# EAGLE design V21-Selector-Keyboard-Relay-K-R-RevD-S (EAGLE 8.3.1)
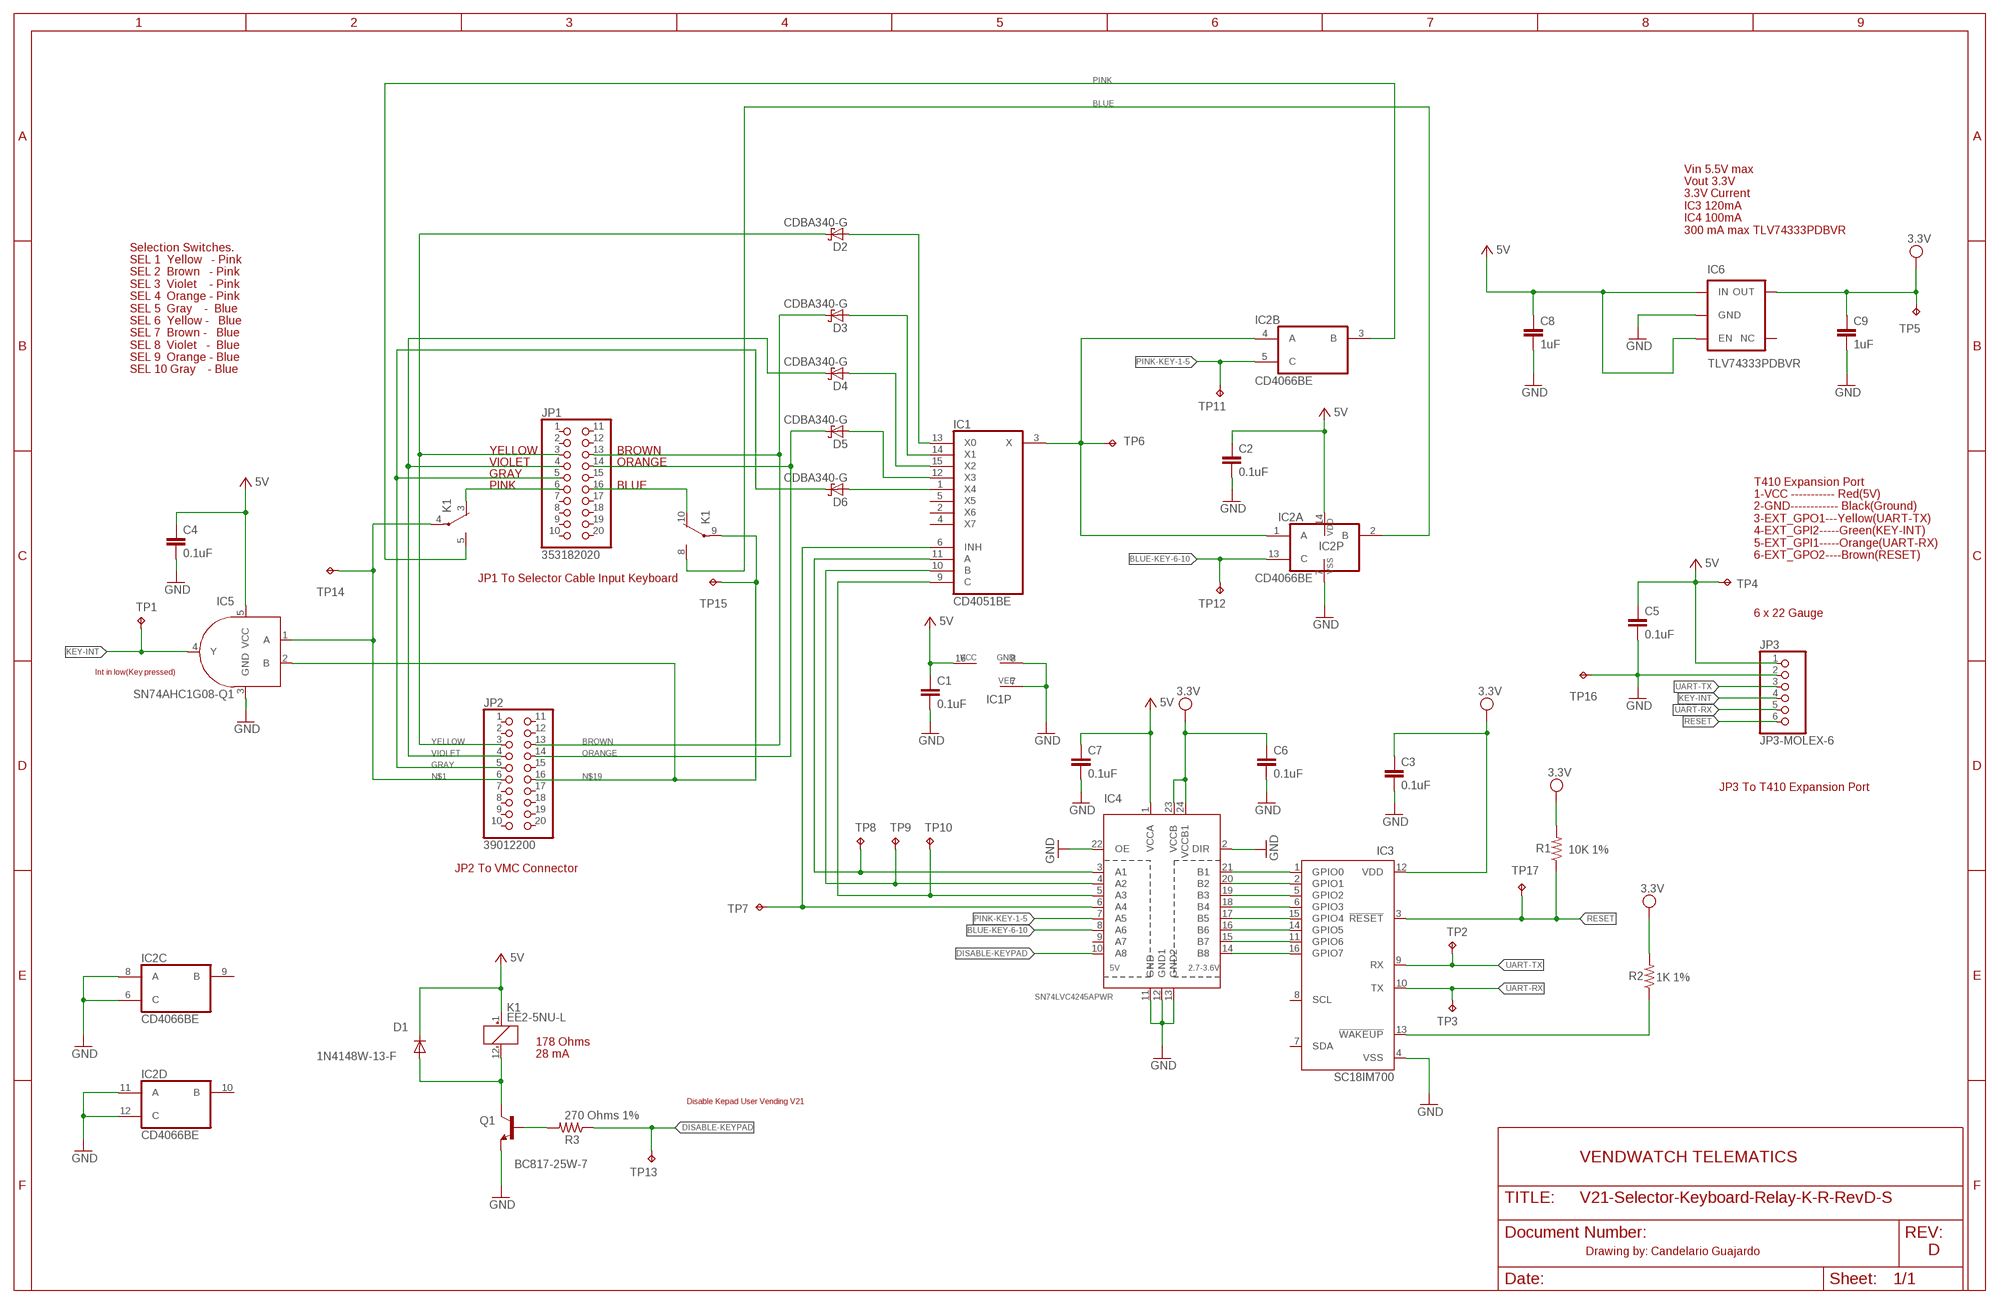
[diagram p0: schematic, sheet 1]

## Parts
C1  0.1uF  CAP0805  [0805]
C2  0.1uF  CAP0805  [0805]
C3  0.1uF  CAP0805  [0805]
C4  0.1uF  CAP0805  [0805]
C5  0.1uF  CAP0805  [0805]
C6  0.1uF  CAP0805  [0805]
C7  0.1uF  CAP0805  [0805]
C8  1uF  CAP0805  [0805]
C9  1uF  CAP0805  [0805]
D1  1N4148W-13-F  DIODESOD-123  [SOD-123]
D2  CDBA340-G  [DO-214AC-SMA]
D3  CDBA340-G  [DO-214AC-SMA]
D4  CDBA340-G  [DO-214AC-SMA]
D5  CDBA340-G  [DO-214AC-SMA]
D6  CDBA340-G  [DO-214AC-SMA]
IC1  CD4051BE  4051D  [SO16]
IC2  CD4066BE  4066D  [SO14]
IC3  SC18IM700  [TSSOP16]
IC4  SN74LVC4245APWR  SN74LVC4245  [SOIC24]
IC5  SN74AHC1G08-Q1  74AHC1G08  [SOT23-5]
IC6  TLV74333PDBVR  [SOT-23-5]
JP1  353182020  [2X10-4.2MM-TH-RA]
JP2  39012200  [2X10-4.2MM-FS-CRIMP]
JP3  JP3-MOLEX-6  [HEADER-1X6-22-GAUGE-OVAL]
K1  EE2-5NU-L  [DPDT-2-FROM-C-EE2]
Q1  BC817-25W-7  TRANSISTOR-NPN  [SOT323]
R1  10K 1%  RESISTOR0805-RES  [0805]
R2  1K 1%  RESISTOR0805-RES  [0805]
R3  270 Ohms 1%  RESISTOR0805-RES  [0805]
TP1  TPB1,27  [B1,27]
TP2  TPB1,27  [B1,27]
TP3  TPB1,27  [B1,27]
TP4  TPB1,27  [B1,27]
TP5  TPB1,27  [B1,27]
TP6  TPB1,27  [B1,27]
TP7  TPB1,27  [B1,27]
TP8  TPB1,27  [B1,27]
TP9  TPB1,27  [B1,27]
TP10  TPB1,27  [B1,27]
TP11  TPB1,27  [B1,27]
TP12  TPB1,27  [B1,27]
TP13  TPB1,27  [B1,27]
TP14  TPB1,27  [B1,27]
TP15  TPB1,27  [B1,27]
TP16  TPB1,27  [B1,27]
TP17  TPB1,27  [B1,27]

## Nets
3.3V: C3.1 C6.1 C9.1 IC3.12(VDD) IC4.23(VCCB) IC4.24(VCCB1) IC6.5(OUT) R1.2 R2.2 TP5.TP
5V: C1.1 C2.1 C4.1 C5.1 C7.1 C8.1 D1.C IC1.16(VCC) IC2.14(P:VDD) IC4.1(VCCA) IC5.5(VCC) IC6.1(IN) IC6.3(EN) JP3.1 K1.1(K$1:+) TP4.TP
BLUE: IC2.2(A:B) K1.8(S)
BLUE-KEY-6-10: IC2.13(A:C) IC4.8(A6) TP12.TP
BROWN: D3.K(C) JP1.13 JP2.13
DISABLE-KEYPAD: IC4.10(A8) R3.1 TP13.TP
GND: C1.2 C2.2 C3.2 C4.2 C5.2 C6.2 C7.2 C8.2 C9.2 IC1.7(VEE) IC1.8(GND) IC2.6(C:C) IC2.7(P:VSS) IC2.8(C:A) IC2.11(D:A) IC2.12(D:C) IC3.4(VSS) IC4.2(DIR) IC4.11(GND) IC4.12(GND1) IC4.13(GND2) IC4.22(OE) IC5.3(GND) IC6.2(GND) JP3.2 Q1.2(E) TP16.TP
GRAY: D6.K(C) JP1.5 JP2.5
KEY-INT: IC5.4(Y) JP3.4 TP1.TP
N$1: IC5.1(A) JP2.6 K1.4(P) TP14.TP
N$3: JP1.6 K1.3(O)
N$4: JP1.16 K1.10(O)
N$5: IC3.13(!WAKEUP) R2.1
N$6: IC3.1(GPIO0) IC4.21(B1)
N$7: IC3.2(GPIO1) IC4.20(B2)
N$8: IC1.6(INH) IC4.6(A4) TP7.TP
N$9: IC1.3(X) IC2.1(A:A) IC2.4(B:A) TP6.TP
N$10: IC3.5(GPIO2) IC4.19(B3)
N$11: IC3.6(GPIO3) IC4.18(B4)
N$12: IC1.11(A) IC4.3(A1) TP8.TP
N$13: IC1.10(B) IC4.4(A2) TP9.TP
N$14: IC1.9(C) IC4.5(A3) TP10.TP
N$15: IC3.15(GPIO4) IC4.17(B5)
N$16: IC3.14(GPIO5) IC4.16(B6)
N$17: IC3.11(GPIO6) IC4.15(B7)
N$18: IC3.16(GPIO7) IC4.14(B8)
N$19: IC5.2(B) JP2.16 K1.9(P) TP15.TP
N$20: D1.A K1.12(K$1:-) Q1.3(C)
N$21: D2.A IC1.13(X0)
N$22: Q1.1(B) R3.2
N$24: D3.A IC1.14(X1)
N$25: D4.A IC1.15(X2)
N$26: D5.A IC1.12(X3)
N$27: D6.A IC1.1(X4)
ORANGE: D5.K(C) JP1.14 JP2.14
PINK: IC2.3(B:B) K1.5(S)
PINK-KEY-1-5: IC2.5(B:C) IC4.7(A5) TP11.TP
RESET: IC3.3(!RESET) JP3.6 R1.1 TP17.TP
UART-RX: IC3.10(TX) JP3.5 TP3.TP
UART-TX: IC3.9(RX) JP3.3 TP2.TP
VIOLET: D4.K(C) JP1.4 JP2.4
YELLOW: D2.K(C) JP1.3 JP2.3
Unconnected: IC1.2(X6) IC1.4(X7) IC1.5(X5) IC2.9(C:B) IC2.10(D:B) IC3.7(SDA) IC3.8(SCL) IC4.9(A7) IC6.4(NC) JP1.1 JP1.2 JP1.7 JP1.8 JP1.9 JP1.10 JP1.11 JP1.12 JP1.15 JP1.17 JP1.18 JP1.19 JP1.20 JP2.1 JP2.2 JP2.7 JP2.8 JP2.9 JP2.10 JP2.11 JP2.12 JP2.15 JP2.17 JP2.18 JP2.19 JP2.20

## Notes on the sheet
- Vin 5.5V max
  Vout 3.3V
  3.3V Current
  IC3 120mA
  IC4 100mA
  300 mA max TLV74333PDBVR
- Selection Switches.
  SEL 1  Yellow   - Pink
  SEL 2  Brown   - Pink
  SEL 3  Violet    - Pink
  SEL 4  Orange - Pink
  SEL 5  Gray    -  Blue
  SEL 6  Yellow -   Blue
  SEL 7  Brown -   Blue
  SEL 8  Violet   -  Blue
  SEL 9  Orange - Blue
  SEL 10 Gray    - Blue
- YELLOW | BROWN
- VIOLET | ORANGE
- GRAY
- PINK | BLUE
- T410 Expansion Port
  1-VCC ----------- Red(5V)
  2-GND------------ Black(Ground)
  3-EXT_GPO1---Yellow(UART-TX)
  4-EXT_GPI2-----Green(KEY-INT)
  5-EXT_GPI1-----Orange(UART-RX) 
  6-EXT_GPO2----Brown(RESET)
- JP1 To Selector Cable Input Keyboard
- 6 x 22 Gauge
- Int in low(Key pressed)
- JP3 To T410 Expansion Port
- JP2 To VMC Connector
- 178 Ohms
  28 mA
- Disable Kepad User Vending V21
- VENDWATCH TELEMATICS
- Drawing by: Candelario Guajardo | D

## Library data of the parts
C1-C9 = SparkFun-Capacitors:CAP: Capacitor Standard 0603 ceramic capacitor, and 0.1" leaded capacitor.
D1 = microbuilder:DIODE: Diode SMA Model Volts Amps Type Vf Vr Digikey # Notes SSA34-E3 40V 3A Schottky 480mV @ 3A 200uA @ 40V SSA34-E3/61TGITR-ND CDBA120-G 20V 1A Schottky 500mV @ 1A 500uA @ 20V 641-1014-6-ND REEL MBRA210 10V 2A Schottky 350mV @ 2A 700uA @ 10V MBRA210LT3 SOD-123 Model Volts Amps Type Vf Vr Order # Notes BAT54T1G 30V 200mA Schottky 800mV @ 200mA 2uA @ 25V BAT54T1GOSTR-ND B0530W 30V 500mA Schottky 430mV @ 500mA 130uA @ 30V B0530W-FDICT-ND REEL MBR120 1A 20V Schottky 340mV @ 1A MBR120VLSFT1GOSCT-ND SOD-323 Model Volts Amps Type Vf Vr Order # Notes PMEG2005EJ 20V 500mA Schottky 355mV @ 500mA 568-4110-1-ND ZLLS410 10V 570mA Schottky 380mV @ 570mA ZLLS410CT-ND 1N4148WS 75V 150mA Silicon/Simple 1V 1N4148WSFSCT-ND REEL SOD-523 Model Volts Amps Type Vf Vr Order # Notes BAT54XV2 30V 200mA Schottky 0.8V @ 100mA BAT54XV2CT-ND TB751S 30V 30mA Schottky RB751S-40TE61CT-ND SOT23-R/W (R = Solder Paste/Reflow Ovens, W = Hand-Soldering) Model Volts Amps Type Vf Vr Order # Notes BAT54FILM 40V 300mA Schottky 497-7162-1-ND
D2-D6 = Comchip-Technology-Schottky Diodes:CDBA340-G: Schottky Diodes & Rectifiers Schottky Barr Rectfr 40V, 3A SMD/SMT DO-214AC-2 Vf 0.5V Ir 0.5mA Comchip Technology CDBA340-G
IC1 = 40xx:4051: 8-channel ANALOG MULTIPLEXER
IC2 = 40xx:4066: Quad bilateral ANALOG SWITCH
IC3 = uart-gpio:SC18IM700: I/O Controller Interface IC Master I2C-bus Controller w/UART SMD/SMT TSSOP-16 I/O Controllers I2C, UART 8 I/O Operatng Supply Voltaje 2.4V to 3.6V NXP SC18IM700IPW/S8HP; MANUFACTURER: NXP Semiconductors; MPN: SC18IM700IPW/S8HP
IC4 = VoltajeTranslatorSOIC:SN74LVC4245: SN74LVC4245ADW OCTAL BUS TRANSCEIVER AND 3.3V TO 5V SHIFTER WITH 3 STATE OUTPUTS
IC5 = SparkFun-DigitalIC:74AHC1G08: Single 2-input AND gate
IC6 = Texas-LDO:TLV74333PDBVR: LDO Voltage Regulators 300mA Low-Dropout (LDO) Regulator SOT-23-5 SMD/SMT 3.3V Input Voltage Max 5.5V Temperature -40C to 125C Texas Instruments TLV74333PDBVR
JP1 = Molex-Mini-Fit-Jr:353182020: Connector Header Through Hole, Right Angle 20 position 0.165" (4.20mm) MOLEX Mini-Fit-Jr 035182020
JP2 = Molex-Mini-Fit-Jr:39012200
JP3 = MOLEX-Nano-Fit:JP3-MOLEX-6
K1 = Kemet-Relay:EE2-5NU-L: General Purpose Relay DPDT (2 Form C) Surface Mount Coil Voltage 5VDC Contact Form DPDT (2 Form 2) 2A Contact Rating Switching Voltage 250VAC, 220VDC-Max Coil Current 28mA Coil Type Non Latching Must Operate Voltage 3.75 VDC Must Release Voltage 0.5 VDC Operate Time 2ms Release Time 1ms Contact Material Silver Alloy, Gold Alloy Coil Resistance 178 Ohms KEMET EE2-5NU-L
Q1 = TRANSISTOR-NPN-Q1:TRANSISTOR-NPN: SMALL SIGNAL TRANSISTOR NPN 45V IN SOT323
R1-R3 = SparkFun-Resistors:RESISTOR: Resistor Basic schematic elements and footprints for 0603, 1206, and PTH resistors.
TP1-TP17 = testpad:TP: Test pad

## Net classes
2 VCC: width 0.254 mm, clearance 0.203 mm

## Board
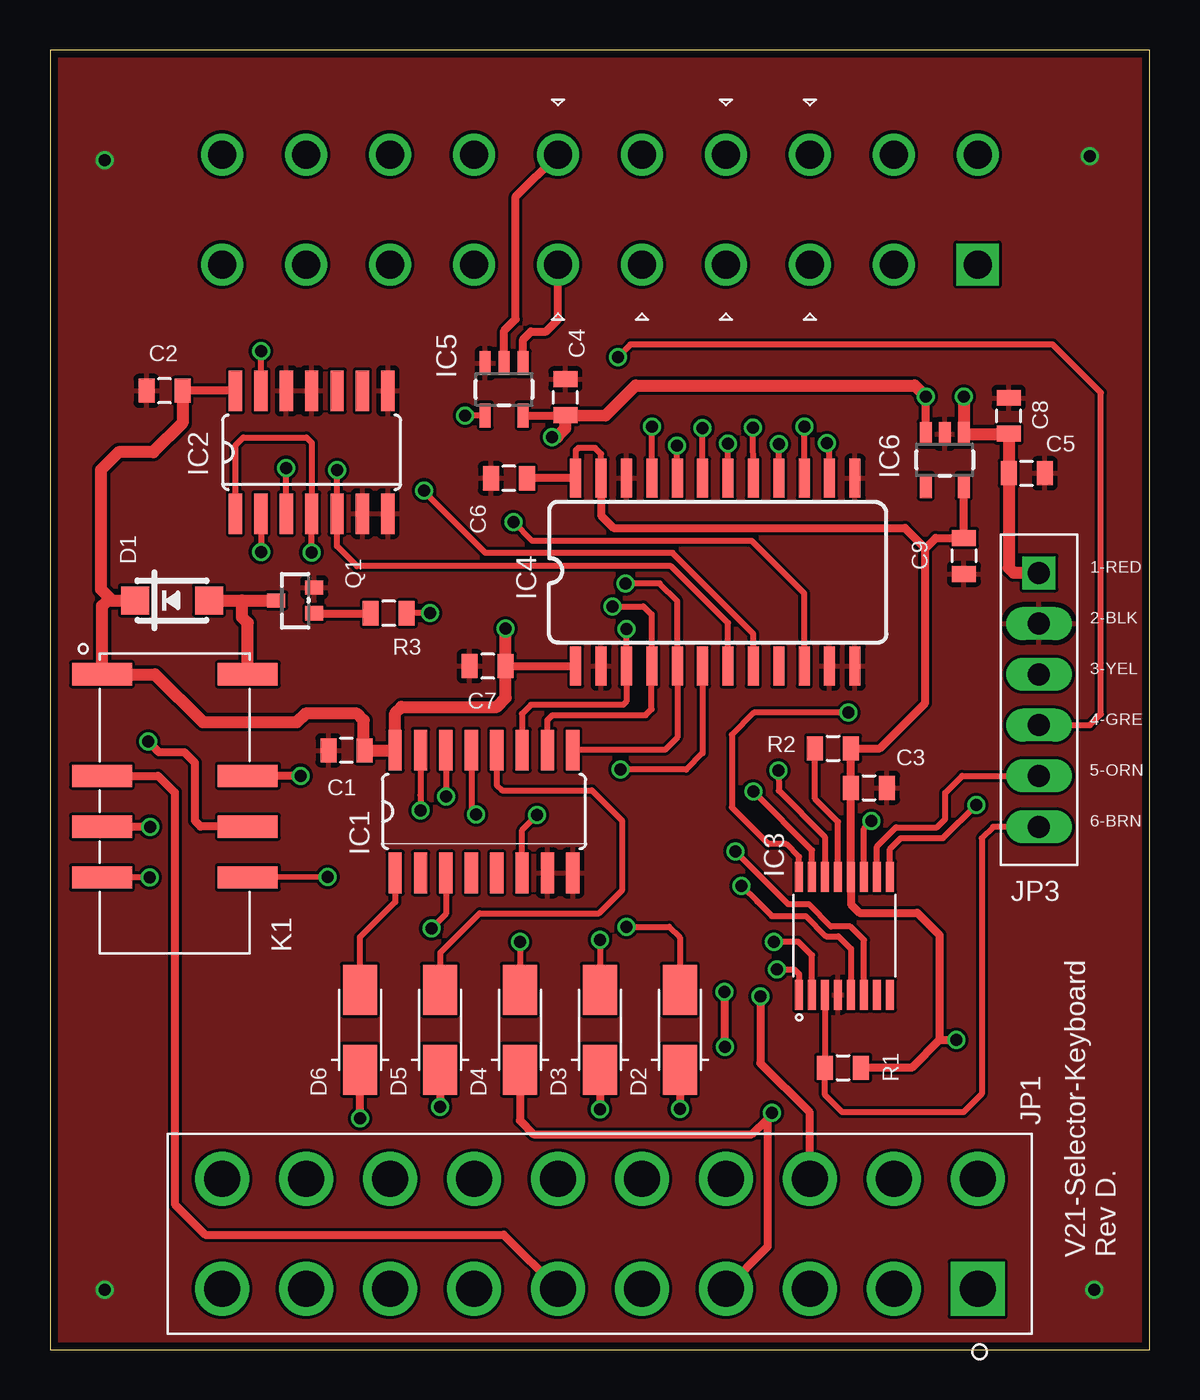
[diagram p1: board, top side]
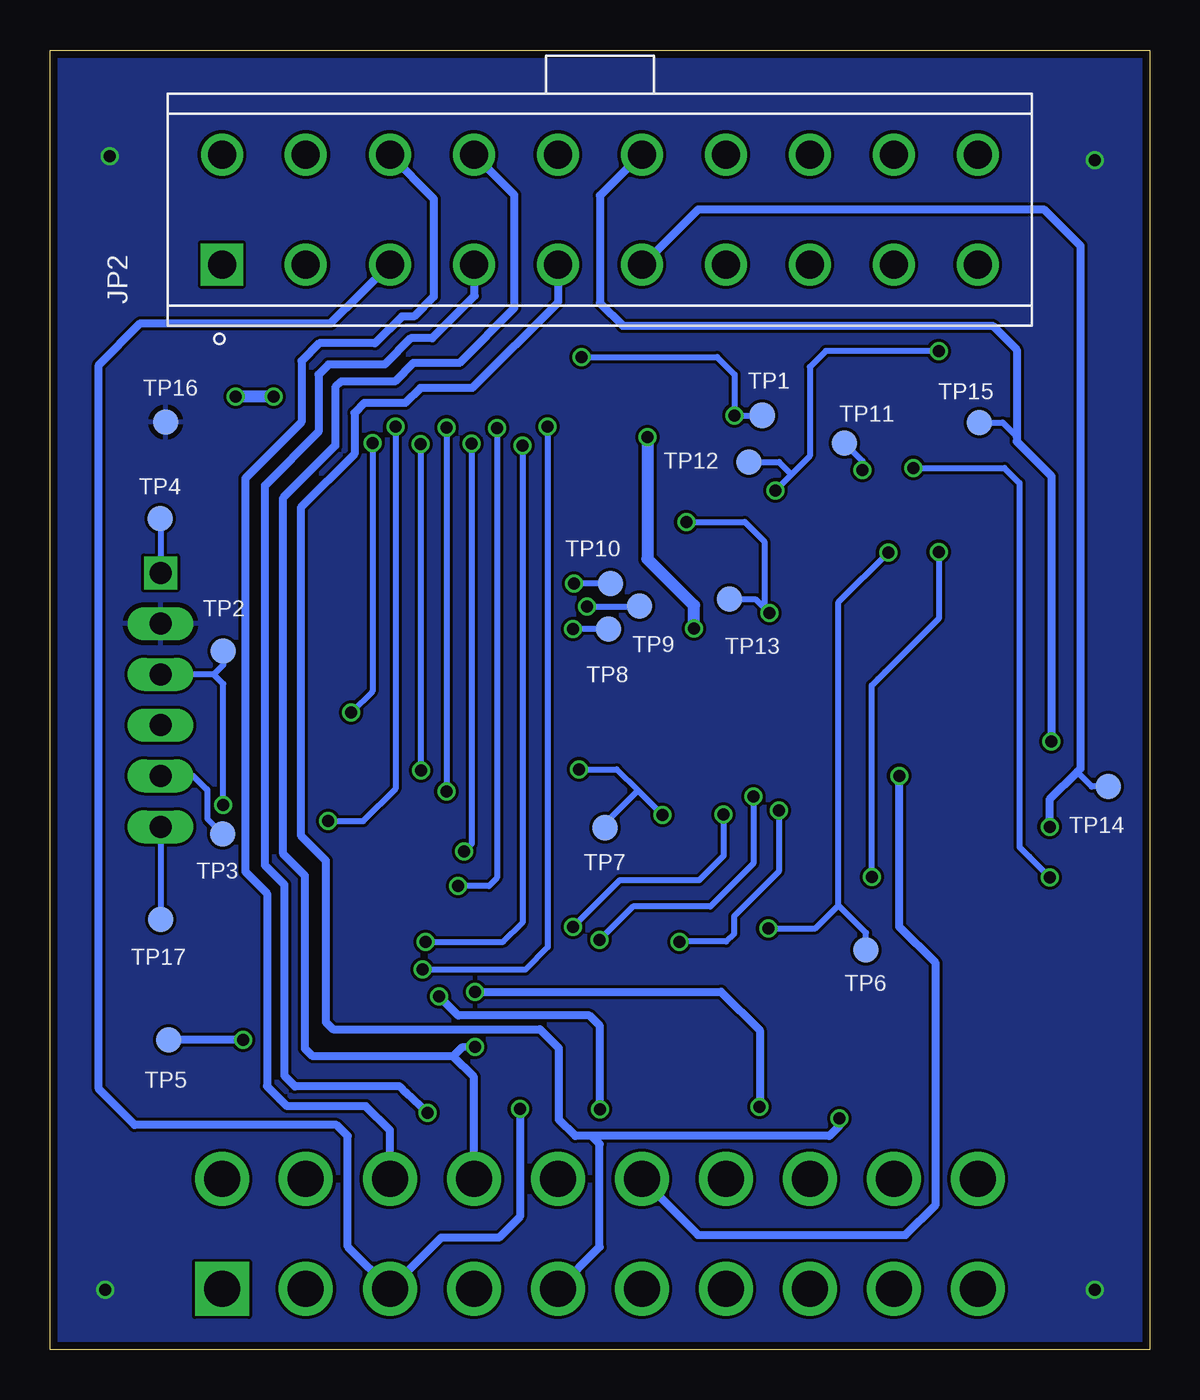
[diagram p2: board, bottom side, seen from below]

Size 55 x 65 mm. Coordinates in mm from the lower left corner, seen from the top.
Outline: 0,0 55,0 55,65 0,65 0,0
Copper layers (1*16): Top 0.035559375mm / dielectric 1.6mm / Bottom 0.035559375mm
Design rules "oshpark-2layer": minimum track width 6mil, minimum drill 10mil, track to track 6mil, track to pad 6mil, pad to pad 6mil, via to via 6mil, smd to smd 6mil, copper to edge 15mil, drill to drill 6mil, minimum pad ring 5mil, minimum via ring 5mil, stop-mask expansion 2.5mil, vias tented up to drill 0mil, thermal gap 10mil

### Footprints (pad centres in the part's own frame; a part is rotated, then mirrored left to right if it is on the bottom)
0805 = smd 0.8 x 1.2: 1 -0.9,0; 2 0.9,0
SOD-123 = smd 1.4 x 1.4: A 1.85,0; C -1.85,0
DO-214AC-SMA = smd 2.5 x 1.7: A 2,0; K -2,0
SO16 = smd 0.66 x 2.032: 1 -4.445,-3.073; 2 -3.175,-3.073; 3 -1.905,-3.073; 4 -0.635,-3.073; 5 0.635,-3.073; 6 1.905,-3.073; 7 3.175,-3.073; 8 4.445,-3.073; 9 4.445,3.073; 10 3.175,3.073; 11 1.905,3.073; 12 0.635,3.073; 13 -0.635,3.073; 14 -1.905,3.073; 15 -3.175,3.073; 16 -4.445,3.073
SO14 = smd 0.66 x 2.032: 1 -3.81,-3.073; 2 -2.54,-3.073; 3 -1.27,-3.073; 4 0,-3.073; 5 1.27,-3.073; 6 2.54,-3.073; 7 3.81,-3.073; 8 3.81,3.073; 9 2.54,3.073; 10 1.27,3.073; 11 0,3.073; 12 -1.27,3.073; 13 -2.54,3.073; 14 -3.81,3.073
TSSOP16 = smd 0.4 x 1.5: 1 -2.275,-2.95; 2 -1.625,-2.95; 3 -0.975,-2.95; 4 -0.325,-2.95; 5 0.325,-2.95; 6 0.975,-2.95; 7 1.625,-2.95; 8 2.275,-2.95; 9 2.275,2.95; 10 1.625,2.95; 11 0.975,2.95; 12 0.325,2.95; 13 -0.325,2.95; 14 -0.975,2.95; 15 -1.625,2.95; 16 -2.275,2.95
SOIC24 = smd 0.55 x 1.95: 1 -8.315,-4.7; 2 -7.045,-4.7; 3 -5.775,-4.7; 4 -4.505,-4.7; 5 -3.235,-4.7; 6 -1.965,-4.7; 7 -0.695,-4.7; 8 0.575,-4.7; 9 1.845,-4.7; 10 3.115,-4.7; 11 4.385,-4.7; 12 5.655,-4.7; 13 5.655,4.7; 14 4.385,4.7; 15 3.115,4.7; 16 1.845,4.7; 17 0.575,4.7; 18 -0.695,4.7; 19 -1.965,4.7; 20 -3.235,4.7; 21 -4.505,4.7; 22 -5.775,4.7; 23 -7.045,4.7; 24 -8.315,4.7
SOT23-5 = smd 0.55 x 1.2: 1 -0.95,-1.3; 2 0,-1.3; 3 0.95,-1.3; 4 0.95,1.3; 5 -0.95,1.3
SOT-23-5 = smd 0.6 x 1.2: 1 -0.95,-1.3; 2 0,-1.3; 3 0.95,-1.3; 4 0.95,1.3; 5 -0.95,1.3
2X10-4.2MM-TH-RA = drill 1.8 square: 1 18.9,-2.75 | drill 1.8: 2 14.7,-2.75; 3 10.5,-2.75; 4 6.3,-2.75; 5 2.1,-2.75; 6 -2.1,-2.75; 7 -6.3,-2.75; 8 -10.5,-2.75; 9 -14.7,-2.75; 10 -18.9,-2.75; 11 18.9,2.75; 12 14.7,2.75; 13 10.5,2.75; 14 6.3,2.75; 15 2.1,2.75; 16 -2.1,2.75; 17 -6.3,2.75; 18 -10.5,2.75; 19 -14.7,2.75; 20 -18.9,2.75
2X10-4.2MM-FS-CRIMP = drill 1.4 square: 1 -18.9,-2.75 | drill 1.4: 2 -14.7,-2.75; 3 -10.5,-2.75; 4 -6.3,-2.75; 5 -2.1,-2.75; 6 2.1,-2.75; 7 6.3,-2.75; 8 10.5,-2.75; 9 14.7,-2.75; 10 18.9,-2.75; 11 -18.9,2.75; 12 -14.7,2.75; 13 -10.5,2.75; 14 -6.3,2.75; 15 -2.1,2.75; 16 2.1,2.75; 17 6.3,2.75; 18 10.5,2.75; 19 14.7,2.75; 20 18.9,2.75
HEADER-1X6-22-GAUGE-OVAL = drill 1.1 square: 1 0,6.35 | drill 1.1 long: 2 0,3.81; 3 0,1.27; 4 0,-1.27; 5 0,-3.81; 6 0,-6.35
DPDT-2-FROM-C-EE2 = smd 1.11 x 3: 1 -5.08,-3.645; 3 0,-3.645; 4 2.54,-3.645; 5 5.08,-3.645; 8 5.08,3.645; 9 2.54,3.645; 10 0,3.645; 12 -5.08,3.645
SOT323 = smd 0.7 x 0.9: 1 -0.65,-0.95; 2 0.65,-0.95; 3 0,0.95
B1,27 = smd 1.27 x 1.27: TP 0,0

### Placement (x,y rotation side)
C1  14.83,29.98 180 top
C2  5.73,47.95 180 top
C3  40.97,28.1 0 top
C4  25.77,47.63 90 top
C5  48.86,43.83 0 top
C6  22.95,43.58 180 top
C7  21.89,34.18 180 top
C8  47.95,46.7 90 top
C9  45.72,39.69 270 top
D1  6.11,37.47 0 top
D2  31.5,16 90 top
D3  27.5,16 90 top
D4  23.5,16 90 top
D5  19.5,16 90 top
D6  15.5,16 90 top
IC1  21.71,26.91 0 top
IC2  13.09,44.88 0 top
IC3  39.74,20.7 0 top
IC4  34.61,38.88 0 top
IC5  22.71,48.02 180 top
IC6  44.76,44.5 180 top
JP1  27.5,5.79 0 top
JP2  27.5,57.02 0 bottom
JP3  49.47,32.5 0 top
K1  6.25,28.7 270 top
Q1  12.27,37.48 90 top
R1  39.66,14.1 0 top
R2  39.16,30.07 0 top
R3  16.95,36.83 180 top
TP1  19.38,46.73 0 bottom
TP2  46.34,34.94 0 bottom
TP3  46.37,25.78 0 bottom
TP4  49.48,41.57 0 bottom
TP5  49.06,15.48 0 bottom
TP6  14.19,19.99 0 bottom
TP7  27.23,26.1 0 bottom
TP8  27.06,36.04 0 bottom
TP9  25.5,37.18 0 bottom
TP10  26.95,38.31 0 bottom
TP11  15.27,45.34 0 bottom
TP12  20.04,44.4 0 bottom
TP13  21.02,37.53 0 bottom
TP14  2.07,28.16 0 bottom
TP15  8.51,46.37 0 bottom
TP16  49.2,46.38 0 bottom
TP17  49.47,21.52 0 bottom

### Tracks (layer width: path | path; a pad name or v marks a point on that pad's centre or on a via)
3.3V  (via drill 0.6)
  Top 0.305: IC4.23 27.57,44.8 27.27,45.1 26.43,45.1 26.3,44.97 IC4.24
  Top 0.406: IC4.24 C6.1 | IC6.5 C9.1 44.3,40.59 43.78,40.08 | 44.49,15.48 44.49,20.73 43.38,21.84 40.49,21.84 40.06,22.27 IC3.12 C3.1 R2.2 41.51,30.07 43.78,32.35 43.78,40.08 | 44.49,15.48 43.11,14.1 R1.2 | 44.49,15.48 v45.34,15.49 | IC4.23 27.57,41.73 28.2,41.09 42.77,41.09 43.78,40.08
  Bottom 0.406: v45.34,15.49 TP5.TP
5V  (via drill 0.6)
  Top 0.406: IC2.14 C2.1 | C7.1 IC4.1 | IC4.1 | IC6.3 v43.81,47.66 | 17.26,29.98 IC1.16 | IC5.5 26.14,46.73
  Top 0.61: 3.11,37.48 2.88,37.48 2.6,37.2 K1.1 5.25,33.77 7.65,31.38 12.35,31.38 12.78,31.81 15.36,31.81 15.69,31.48 15.69,29.93 C1.1 17.26,29.98 | 3.11,37.48 D1.C | v45.71,47.66 IC6.1 C8.1 C5.1 47.96,39.1 48.2,38.86 JP3.1 | C2.1 6.63,46.34 5.17,44.88 3.44,44.88 2.56,44.01 2.56,38.02 3.11,37.48 | C4.1 27.8,46.73 29.3,48.23 43.25,48.23 v43.81,47.66 | IC1.16 17.27,31.83 17.58,32.15 22.35,32.15 22.8,32.59 C7.1 22.8,36.05 v22.78,36.06 | 26.14,46.73 C4.1 | C4.1 25.77,46.08 25.36,45.63 25.12,45.63 v25.11,45.65
  Bottom 0.305: TP4.TP JP3.1
  Bottom 0.406: v45.7,47.66 v45.71,47.66
  Bottom 0.61: v43.81,47.66 v45.7,47.66 | v25.11,45.65 25.11,39.55 22.78,37.22 v22.78,36.06
BLUE  (via drill 0.6)
  Top 0.305: IC2.2 v10.55,39.9 | v13.89,23.63 K1.8
  Bottom 0.305: v10.55,39.9 10.55,36.56 13.21,33.9 13.57,33.54 13.89,33.22 v13.89,23.63
BLUE-KEY-6-10  (via drill 0.6)
  Top 0.305: IC2.13 v10.55,49.95 | v18.7,42.98 18.7,42.92 21.78,39.84 31.14,39.84 35.19,35.8 IC4.8
  Bottom 0.305: v10.55,49.95 16.2,49.95 16.99,49.15 16.99,44.69 17.91,43.77 | 17.91,43.77 v18.7,42.98 | TP12.TP 18.54,44.4 17.91,43.77
BROWN  (via drill 0.6)
  Top 0.406: D3.K v27.5,12.03 | v35.53,17.66 35.53,14.32 38,11.86 JP1.13
  Bottom 0.406: JP2.13 38,59.76 35.8,57.56 35.8,52.66 36.79,51.67 37.4,51.67 38.75,50.33 41.53,50.33 42.41,49.44 42.41,46.39 45.23,43.57 45.23,23.91 44.14,22.81 44.14,13.18 43.13,12.17 39.2,12.17 38,10.97 JP1.13 | v27.5,12.03 27.5,16.18 28.02,16.71 34.59,16.71 v35.53,17.66
DISABLE-KEYPAD  (via drill 0.6)
  Top 0.305: IC4.10 37.73,37.83 35.1,40.45 24.12,40.45 v23.18,41.4 | v19.02,36.83 R3.1
  Bottom 0.305: v23.18,41.4 20.25,41.4 19.27,40.42 19.27,37.08 v19.02,36.83 19.73,37.53 TP13.TP
GND  (via drill 0.6)
  other vias: 2.74,2.98 52.02,59.7 2.74,59.48 52.24,2.98
  pour Top: 0,0 55,0 55.01,64.98 0.01,64.98
  pour Bottom: 0,0 55,0 55.01,65 0,64.98
GRAY  (via drill 0.6)
  Top 0.406: v15.51,11.56 D6.K
  Bottom 0.406: JP1.5 27.51,5.13 27.51,10.28 27.91,10.68 | JP2.5 29.6,52.38 33.88,48.09 36.48,48.09 37.23,47.34 39.28,47.34 39.77,46.85 39.77,44.79 42.46,42.1 42.46,25.72 41.2,24.46 41.2,16.38 40.84,16.02 30.5,16.02 29.54,15.06 29.54,11.49 28.73,10.68 27.91,10.68 | v15.51,11.56 15.51,11.2 16.02,10.68 27.91,10.68
KEY-INT  (via drill 0.6)
  Top 0.305: IC5.4 v20.76,46.73 | v20.76,46.73 | JP3.4 52.02,31.23 52.57,31.79 52.57,47.85 50.16,50.27 29.03,50.27 v28.41,49.64
  Bottom 0.305: TP1.TP v20.76,46.73 20.76,48.77 21.63,49.64 v28.41,49.64
N$1  (via drill 0.6)
  Top 0.406: IC5.1 23.66,50.52 24.06,50.92 24.82,50.92 25.41,51.51 JP2.6 | v5,26.15 K1.4
  Bottom 0.305: TP14.TP 2.89,28.16 3.62,28.89
  Bottom 0.406: JP2.6 25.33,54.27 22.57,57.03 5.29,57.03 3.46,55.2 3.46,29.05 3.62,28.89 5.01,27.5 v5.01,26.16 v5,26.15
N$3
  Top 0.406: K1.3 5.41,28.7 6.24,27.86 6.24,7.27 7.77,5.74 22.7,5.74 JP1.6
N$4  (via drill 0.6)
  Top 0.406: v12.53,28.7 K1.10
  Bottom 0.406: JP1.16 22.6,5.74 12.21,5.74 10.7,7.24 10.7,19.33 12.52,21.14 12.52,28.69 v12.53,28.7
N$5
  Top 0.305: IC3.13 39.41,26.4 38.27,27.55 38.27,30.27 R2.1
N$6  (via drill 0.6)
  Top 0.305: IC4.21 v30.11,46.16 | v36.37,19.01 37.24,19.01 37.47,18.79 IC3.1
  Bottom 0.305: v30.11,46.16 30.11,20.13 31.23,19.01 v36.37,19.01
N$7  (via drill 0.6)
  Top 0.305: IC4.20 v31.36,45.23 | IC3.2 38.12,19.71 37.44,20.39 v36.22,20.39
  Bottom 0.305: v31.36,45.23 31.38,21.35 32.33,20.39 v36.22,20.39
N$8  (via drill 0.6)
  Top 0.305: IC4.6 32.65,29.83 31.82,29.01 v28.56,29.01 v28.55,29.02 | IC1.6 23.62,25.98 v24.36,26.73
  Bottom 0.305: v28.55,29.02 26.66,29.02 25.59,27.95 | 25.59,27.95 v24.36,26.73 | TP7.TP 27.23,26.31 25.59,27.95
N$9  (via drill 0.6)
  Top 0.305: IC2.1 9.28,45.23 9.66,45.62 12.82,45.62 13.09,45.35 IC2.4 13.07,41.79 v13.07,39.88 | IC1.3 19.8,21.8 v19.07,21.07
  Bottom 0.305: v19.07,21.07 16.7,21.07 15.55,22.21 | 15.55,22.21 15.55,37.4 v13.07,39.88 | TP6.TP 14.19,20.84 15.55,22.21
N$10  (via drill 0.6)
  Top 0.305: IC4.19 v32.65,46.09 v32.64,46.1 | IC3.5 40.06,20.04 39.43,20.68 38.81,20.68 37.8,21.68 36.1,21.68 35.38,22.41 v34.59,23.18
  Bottom 0.305: v32.64,46.1 32.64,23.59 33.05,23.18 v34.59,23.18
N$11  (via drill 0.6)
  Top 0.305: IC4.18 33.91,45.3 v33.91,45.32 | IC3.6 40.72,20.48 40.03,21.16 39.07,21.16 37.95,22.28 36.92,22.28 34.3,24.91 34.3,24.93 v34.28,24.93
  Bottom 0.305: v33.91,45.32 33.91,25.3 v34.28,24.93
N$12  (via drill 0.6)
  Top 0.305: IC1.11 23.61,29.99 23.61,31.8 24.05,32.24 28.66,32.24 28.84,32.41 IC4.3 28.84,35.95 v28.84,36.03
  Bottom 0.305: TP8.TP v28.84,36.04 v28.84,36.03
N$13  (via drill 0.6)
  Top 0.305: v28.13,37.16 29.68,37.17 30.09,36.77 30.09,34.2 IC4.4 30.09,34.16 30.09,32.03 29.79,31.73 25.14,31.73 24.89,31.48 IC1.10
  Bottom 0.305: v28.13,37.16 25.52,37.17 TP9.TP
N$14  (via drill 0.6)
  Top 0.305: IC1.9 26.17,30 30.76,30 31.38,30.61 IC4.5 31.38,37.44 30.5,38.31 v28.8,38.31
  Bottom 0.305: TP10.TP v28.8,38.31
N$15  (via drill 0.6)
  Top 0.305: IC4.17 v35.16,46.12 | IC3.15 38.12,24.98 v35.17,27.91
  Bottom 0.305: v35.16,46.12 35.16,27.93 v35.17,27.91
N$16  (via drill 0.6)
  Top 0.305: IC4.16 v36.45,45.28 | v36.45,28.96 36.45,27.96 38.76,25.65 IC3.14
  Bottom 0.305: v36.45,45.28 36.45,28.98 v36.45,28.96
N$17  (via drill 0.6)
  Top 0.305: IC4.15 v37.73,46.16 | IC3.11 40.72,26.05 v41.09,26.43
  Bottom 0.305: v41.09,26.43 39.34,26.43 37.72,28.05 v37.73,46.16
N$18  (via drill 0.6)
  Top 0.305: IC4.14 38.99,45.21 v38.87,45.34 | IC3.16 37.47,24.65 36.83,25.29 35.94,25.29 34.11,27.11 34.11,30.75 35.22,31.86 v39.94,31.86
  Bottom 0.305: v38.87,45.34 38.87,32.92 v39.94,31.86
N$19  (via drill 0.6)
  Top 0.406: IC5.2 22.72,50.96 23.3,51.53 23.3,57.67 JP2.16 | K1.9 7.54,26.16 7.25,26.44 7.25,29.34 6.72,29.87 5.46,29.87 v4.91,30.42
  Bottom 0.305: TP15.TP 7.34,46.37 6.65,45.67
  Bottom 0.406: JP2.16 25.43,59.77 27.5,57.72 27.5,52.34 26.35,51.2 7.84,51.2 6.65,50.01 6.65,45.67 6.65,45.42 4.91,43.68 v4.91,30.42
N$20
  Top 0.61: D1.A 9.61,37.47 | 9.61,37.47 Q1.3 | K1.12 9.89,36.34 9.61,36.62 9.61,37.47
N$21  (via drill 0.6)
  Top 0.305: IC1.13 21.07,26.98 v21.3,26.75 | v28.83,21.14 30.97,21.14 31.5,20.61 D2.A
  Bottom 0.305: v21.3,26.75 21.3,24.7 22.53,23.47 26.5,23.47 v28.83,21.14
N$22
  Top 0.406: Q1.1 R3.2
N$24  (via drill 0.6)
  Top 0.305: IC1.14 19.8,28.07 v19.82,27.66 | v27.51,20.5 D3.A
  Bottom 0.305: v19.82,27.66 19.82,24.31 21.97,22.16 25.85,22.16 v27.51,20.5
N$25  (via drill 0.6)
  Top 0.305: IC1.15 18.54,27.72 v18.55,26.96 | v23.51,20.39 D4.A
  Bottom 0.305: v23.51,20.39 23.5,20.41 21.18,20.41 20.79,20.8 20.79,21.67 18.55,23.91 v18.55,26.96
N$26
  Top 0.305: IC1.12 22.34,28.23 22.61,27.96 27.1,27.96 28.64,26.43 28.64,23 27.46,21.82 21.49,21.82 19.52,19.85 19.52,18.02 D5.A
N$27
  Top 0.305: IC1.1 17.27,22.39 15.49,20.61 D6.A
ORANGE  (via drill 0.6)
  Top 0.406: D5.K v19.5,12.13 | v33.74,17.89 33.74,15.62 v33.75,15.13
  Bottom 0.406: JP2.14 31.78,57.76 31.78,52.09 34.52,49.34 36.83,49.34 37.74,48.42 40.44,48.42 40.73,48.13 40.73,45.2 43.33,42.6 43.33,24.79 42.24,23.7 42.24,15.05 41.85,14.66 34.83,14.66 | JP1.14 33.8,13.63 34.83,14.66 | v33.75,15.13 34.39,15.11 34.83,14.66 | v33.74,17.89 21.43,17.89 19.5,15.96 v19.5,12.13
PINK  (via drill 0.6)
  Top 0.305: IC2.3 v11.82,44.1 | v4.99,23.61 K1.5
  Bottom 0.305: v4.99,23.61 5.89,24.52 6.01,24.64 6.5,25.14 6.5,43.35 7.25,44.1 v11.82,44.1
PINK-KEY-1-5  (via drill 0.6)
  Top 0.305: IC4.7 33.91,36.34 31.07,39.19 15.35,39.19 14.35,40.19 14.35,41.8 IC2.5 v14.36,43.99
  Bottom 0.305: v14.36,43.99 14.36,44.44 TP11.TP
RESET
  Top 0.305: IC3.3 R1.1 38.77,12.73 39.63,11.87 45.69,11.87 46.6,12.78 46.6,25.58 47.17,26.15 JP3.6
  Bottom 0.305: JP3.6 TP17.TP
UART-RX
  Top 0.305: IC3.10 41.37,25.16 42.32,26.12 44.37,26.12 44.78,26.53 44.78,27.85 45.63,28.7 JP3.5
  Bottom 0.305: 46.44,25.86 TP3.TP 47.13,26.55 47.13,28 47.19,28.05 47.84,28.7 JP3.5
UART-TX  (via drill 0.6)
  Top 0.305: IC3.9 42.02,25.04 42.56,25.58 44.67,25.58 v46.33,27.24
  Bottom 0.305: v46.33,27.24 46.33,33.29 46.81,33.77 | 46.81,33.77 JP3.3 | TP2.TP 46.34,34.24 46.81,33.77
VIOLET  (via drill 0.6)
  Top 0.406: 35.91,11.54 35.91,5.16 JP1.4 | 35.91,11.54 v36.12,11.85 | D4.K 23.5,11.46 24.18,10.78 35.11,10.78 35.91,11.54
  Bottom 0.406: v36.12,11.85 37.19,12.85 37.5,13.16 42.74,13.16 43.27,13.69 43.27,23.25 44.24,24.22 44.24,43.23 41.56,45.91 41.56,48.77 41.06,49.27 38.26,49.27 36.95,50.58 35.88,50.58 33.76,52.7 33.76,54.23 JP2.4
YELLOW  (via drill 0.6)
  Top 0.406: D2.K v31.5,12.04
  Bottom 0.406: JP2.3 40.95,51.33 50.48,51.33 52.56,49.24 52.56,13.03 50.77,11.23 40.66,11.23 40.11,10.68 40.11,5.14 JP1.3 35.44,5.6 32.55,5.6 31.5,6.64 v31.5,12.04

### Text on the board
tPlace: V21-Selector-Keyboard / Rev D.